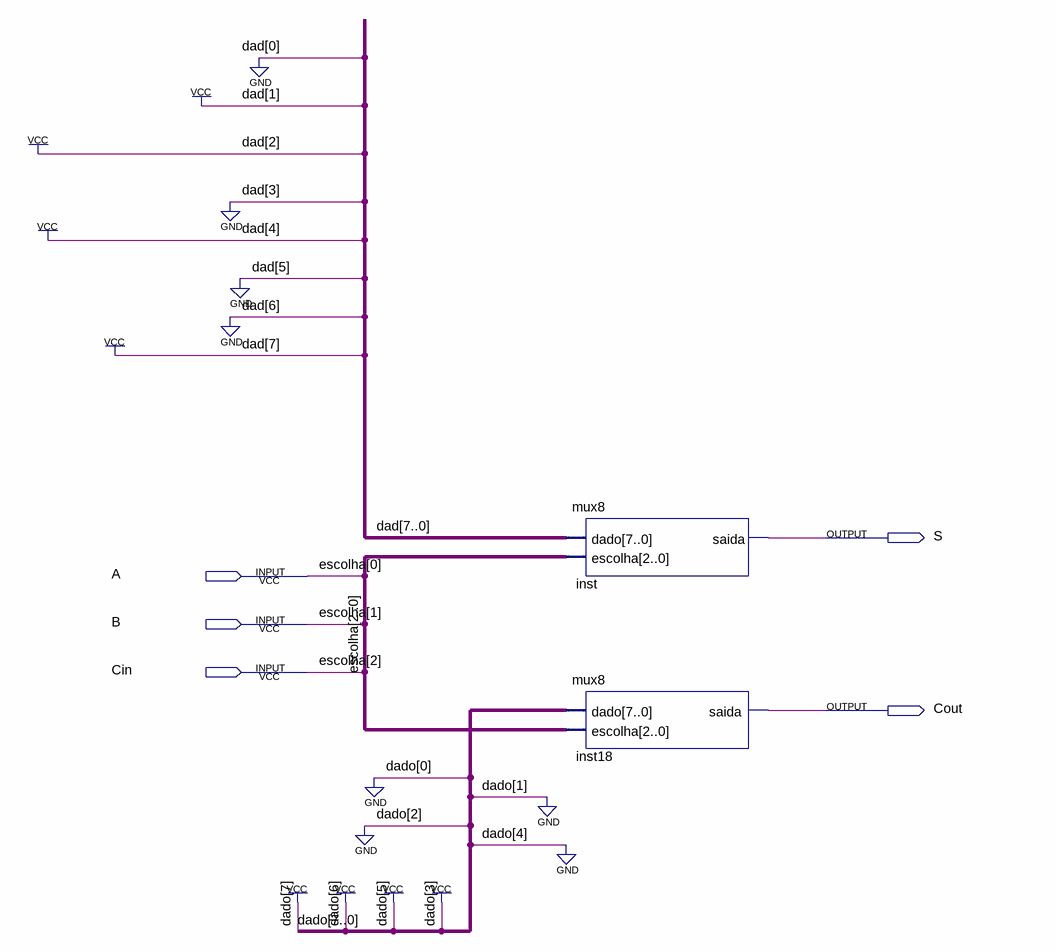
[diagram p0: schematic sheet]
// Quartus schematic trabcl.bdf as structural Verilog: 2 symbols, 5 pins
module trabcl (
  input  A,
  input  B,
  input  Cin,
  output S,
  output Cout
);

  mux8 inst (.dado(8'b10010110), .escolha({Cin, B, A}), .saida(S));
  mux8 inst18 (.dado(8'b11101000), .escolha({Cin, B, A}), .saida(Cout));

  // Other names for the same wires on the sheet: escolha[2:0] = {Cin, B, A}
endmodule
